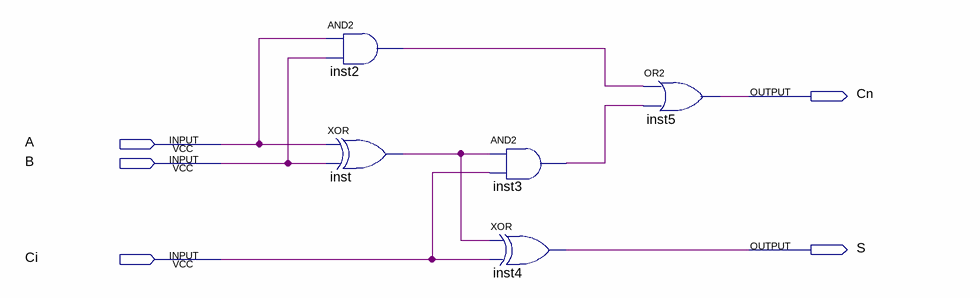
[diagram p0: schematic sheet]
// Quartus schematic Fa.bdf as structural Verilog: 5 symbols, 5 pins
module Fa (
  input  A,
  input  B,
  input  Ci,
  output Cn,
  output S
);

  wire inst2_out, inst3_out, inst_out;

  and inst2 (inst2_out, A, B);
  xor inst (inst_out, A, B);
  and inst3 (inst3_out, inst_out, Ci);
  xor inst4 (S, inst_out, Ci);
  or inst5 (Cn, inst2_out, inst3_out);
endmodule
